# Altium schematic sheet Connectors_Frontend.SchDoc: Connectors - Frontend
size A4; Date: 28.09.2023; ApprovedBy: M.Sc. Tobias Wirth; CheckedBy: M.Sc. Tobias Wirth; Author: M.Sc. Tobias Wirth; CompanyName: University of Stuttgart; DrawnBy: M.Sc. Tobias Wirth; Engineer: M.Sc. Tobias Wirth; Organization: IIS; Address1: Pfaffenwaldring 47; Address2: 70569 Stuttgart; Revision: V1.2; SheetNumber: 9; SheetTotal: 17; ProjectNameAlt: AUS - NMR System; Time: 13:40; ImagePath: N/A; Application_BuildNumber: N/A
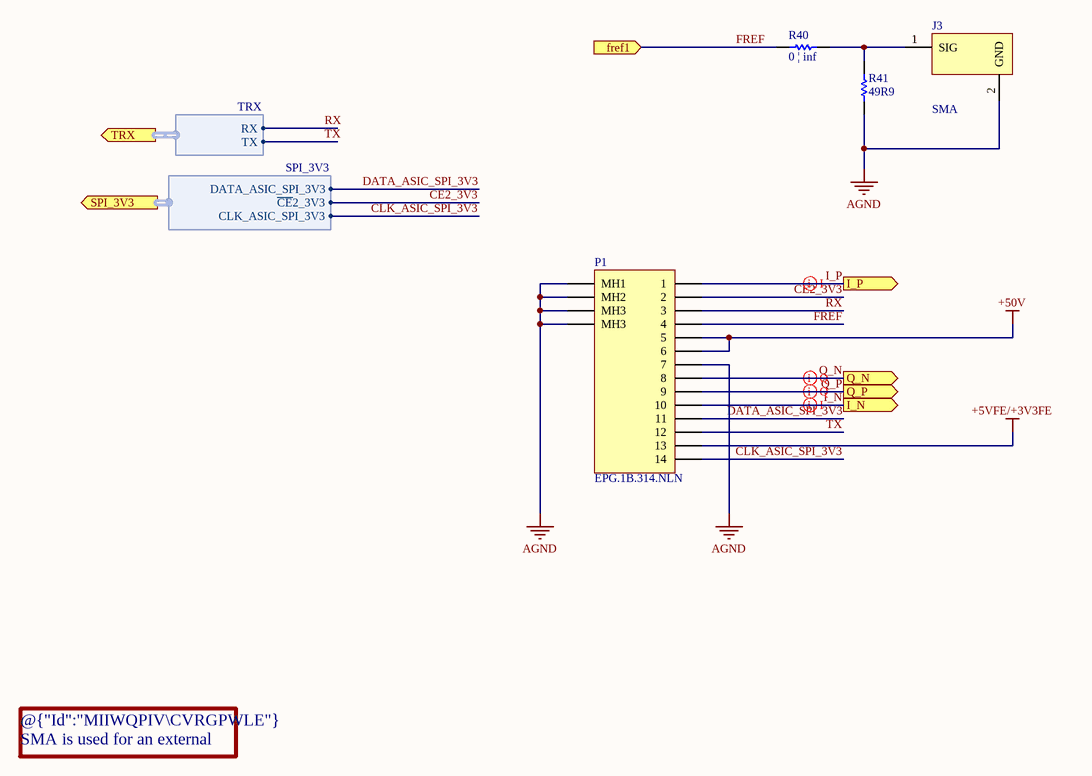
[diagram p0: Connectors_Frontend.SchDoc]

## Parts
J3  SMA  [SMA]
P1  EPG.1B.314.NLN  [EPG.1B.314.NLN]
R40  0 | inf  [RES_0402]
R41  49R9  [RES_0402]

## Ports
fref1 (in), I_N (out), I_P (out), Q_N (out), Q_P (out), SPI_3V3 (out, harness SPI_3V3), TRX (out, harness TRX)

## Harnesses
TRX: TX, RX
SPI_3V3: DATA_ASIC_SPI_3V3, ~{CE}2_3V3, CLK_ASIC_SPI_3V3

## Nets
+5VFE/+3V3FE: P1.13
+50V: P1.5 P1.6
AGND: J3.2(GND) P1.7 P1.15(MH1) P1.16(MH2) P1.17(MH3) P1.18(MH3) R41.1
~{CE}2_3V3: P1.2 ; port SPI_3V3.~{CE}2_3V3
CLK_ASIC_SPI_3V3: P1.14 ; port SPI_3V3.CLK_ASIC_SPI_3V3
DATA_ASIC_SPI_3V3: P1.11 ; port SPI_3V3.DATA_ASIC_SPI_3V3
FREF: P1.4 R40.1 ; port fref1
I_N: P1.10 ; port I_N
I_P: P1.1 ; port I_P
Q_N: P1.8 ; port Q_N
Q_P: P1.9 ; port Q_P
RX: P1.3 ; port TRX.RX
TX: P1.12 ; port TRX.TX
NetJ3_1: J3.1(SIG) R40.2 R41.2

## Layout directives
differential pair; net class LNA_SIG; differential pair class LNA_SIG_Q: Q_N, Q_P
differential pair; differential pair class LNA_SIG_I; net class LNA_SIG: I_N, I_P

## Notes on the sheet
- @{"Id":"MIIWQPIV\CVRGPWLE"} SMA is used for an external reference frequency
- Title
- Size
- Date:
- Sheet
- A4
- of
- Project
- Drawn By:
- Revision:

## Library data of the parts
P1 = EPG.1B.314.NLN: LEMO Connector - 14 pin EPG.1B.314.NLN Elbow receptacle for printed circuit (solder mount), Female Contact Drawing Rev. 00 Source: http://www.lemo.com/catalog/ROW/UK_English/unipole_multipole.pdf
R40 R41 = Res: Part Number: *; Supplier: *
  R40: Value: 0 | inf
  R41: Value: 49R9